# EAGLE design Mosfet Switch (EAGLE 8.4.1)
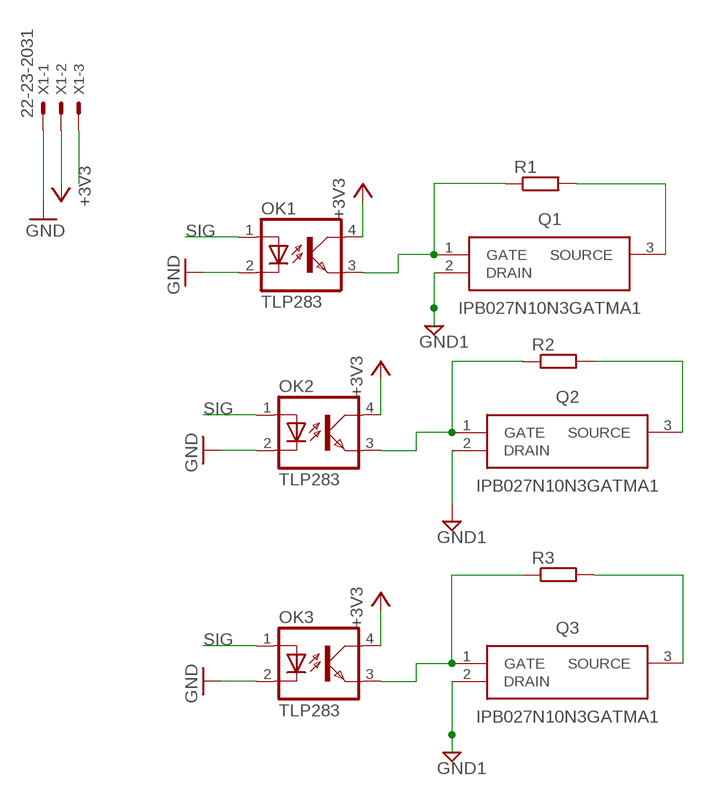
[diagram p0: schematic, sheet 1]

## Parts
OK1  TLP283  [MINI-FLAT-4]
OK2  TLP283  [MINI-FLAT-4]
OK3  TLP283  [MINI-FLAT-4]
Q1  IPB027N10N3GATMA1  [PGTO263-3]
Q2  IPB027N10N3GATMA1  [PGTO263-3]
Q3  IPB027N10N3GATMA1  [PGTO263-3]
R1  R-EU_R0805  [R0805]
R2  R-EU_R0805  [R0805]
R3  R-EU_R0805  [R0805]
X1  22-23-2031  [22-23-2031]

## Nets
+3V3: OK1.4(COL) OK2.4(COL) OK3.4(COL) X1.2
GND1: Q1.2(DRAIN) Q2.2(DRAIN) Q3.2(DRAIN)
GND2: OK1.2(C) OK2.2(C) OK3.2(C) Q1.3(SOURCE) Q2.3(SOURCE) Q3.3(SOURCE) R1.2 R2.2 R3.2 X1.1 ; supply symbol labelled GND
N$1: OK1.3(EMIT) Q1.1(GATE) R1.1
N$4: OK2.3(EMIT) Q2.1(GATE) R2.1
N$5: OK3.3(EMIT) Q3.1(GATE) R3.1
SIG: OK1.1(A) OK2.1(A) OK3.1(A) X1.3

## Library data of the parts
OK1-OK3 = optocoupler:TLP283: TOSHIBA PHOTOCOUPLER GaAs IRED & PHOTO-TRANSISTOR Source: http://www.semicon.toshiba.co.jp/td/en/Opto/Photocoupler/en_20050928_TLP283_datasheet.pdf; OC_FARNELL: unknown; OC_NEWARK: unknown
Q1-Q3 = IPB027N10N3GATMA1:IPB027N10N3GATMA1: INFINEON - IPB027N10N3GATMA1 - MOSFET, N CH, 100V, 120A, TO-263-3 <https://componentsearchengine.com/Images/1/IPB027N10N3GATMA1.jpg> Source: Datasheet <https://www.infineon.com/dgdl/IPB027N10N3 G_Rev2.2.pdf?folderId=db3a304313b8b5a60113cee8763b02d7&fileId=db3a30431ce5fb52011d1ed9348e15ef>; DESCRIPTION: INFINEON - IPB027N10N3GATMA1 - MOSFET, N CH, 100V, 120A, TO-263-3; HEIGHT: mm; MANUFACTURER_NAME: Infineon; MANUFACTURER_PART_NUMBER: IPB027N10N3GATMA1; SUPPLIER_NAME: RS
R1-R3 = resistor:R-EU_: RESISTOR, European symbol
X1 = con-molex:22-23-2031: .100" (2.54mm) Center Header - 3 Pin; MF: MOLEX; MPN: 22-23-2031; OC_FARNELL: 1462950; OC_NEWARK: 30C0862

## Board
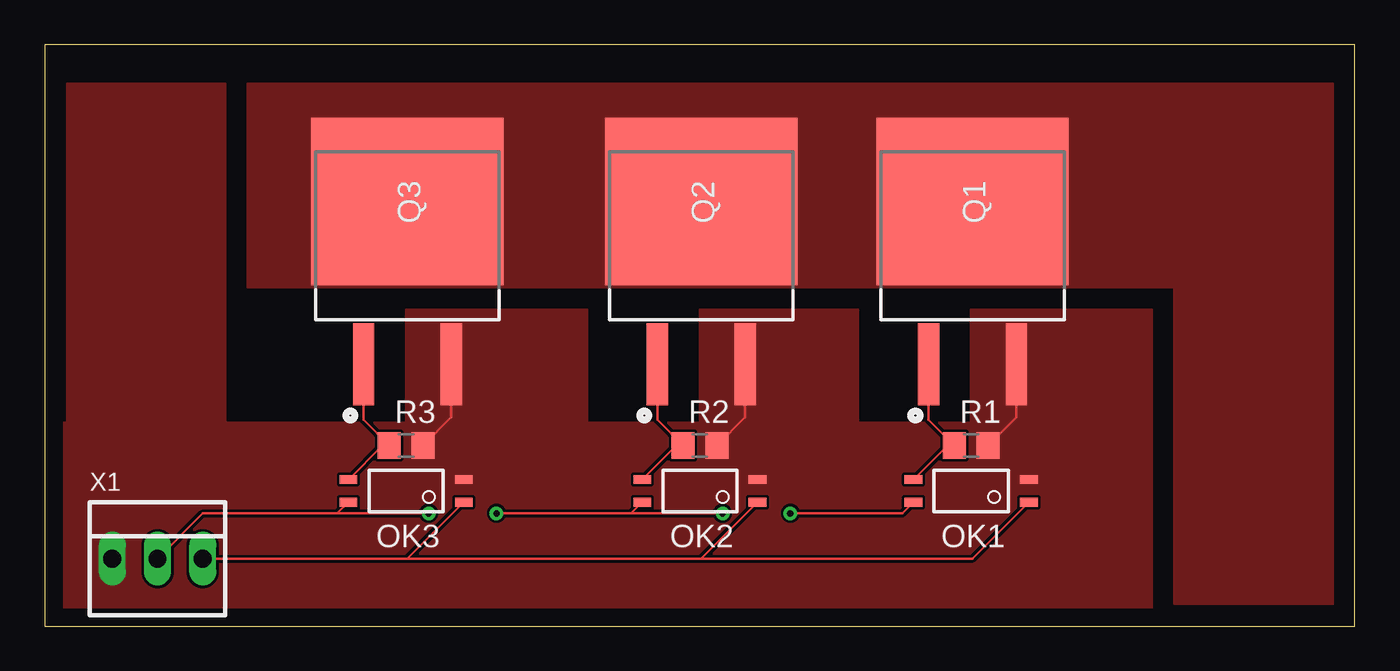
[diagram p1: board, top side]
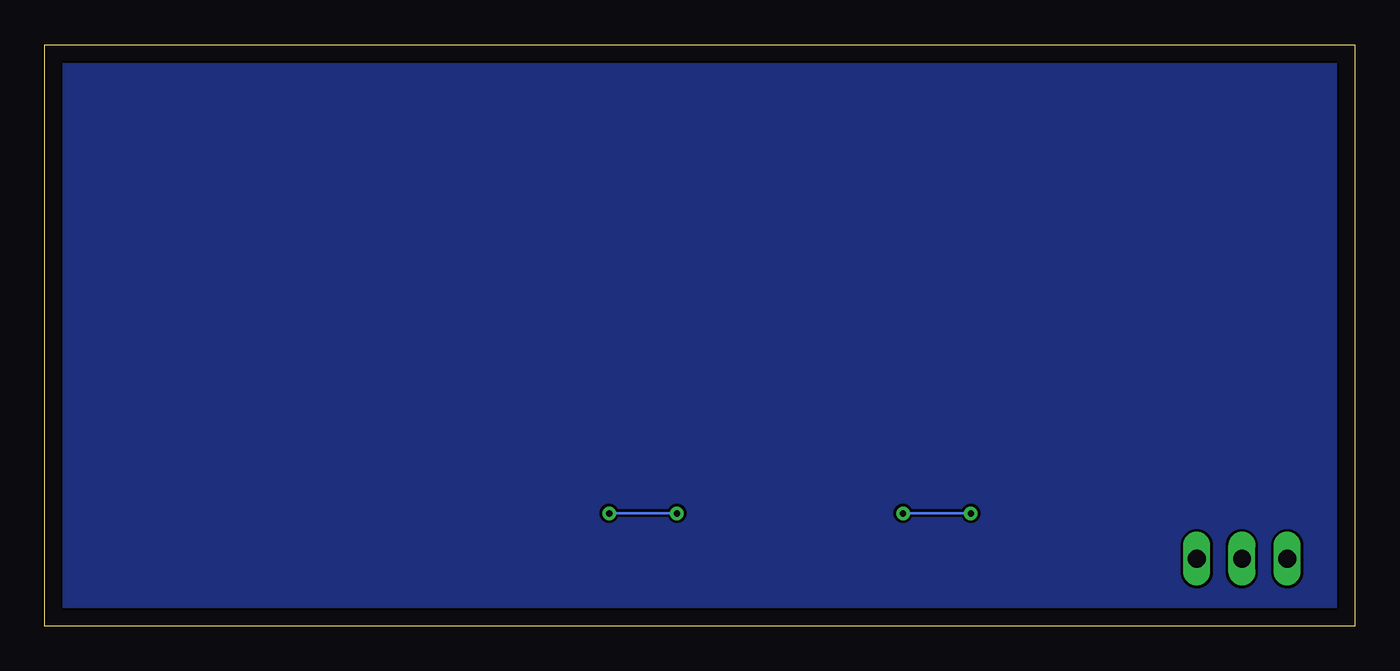
[diagram p2: board, bottom side, seen from below]

Size 73.64 x 32.69 mm. Coordinates in mm from the lower left corner, seen from the top.
Outline: 0,0 73.64,0 73.64,32.69 0,32.69 0,0
Copper layers (1*16): Top 0.035mm / dielectric 1.5mm / Bottom 0.035mm
Design rules "default": minimum track width 6mil, minimum drill 0.35mm, track to track 6mil, track to pad 6mil, pad to pad 6mil, via to via 6mil, smd to smd 6mil, copper to edge 40mil, drill to drill 6mil, minimum pad ring 10mil, minimum via ring 8mil, stop-mask expansion 4mil, vias tented up to drill 0mil, thermal gap 10mil

### Footprints (pad centres in the part's own frame; a part is rotated, then mirrored left to right if it is on the bottom)
MINI-FLAT-4 = smd 1 x 0.5: 1 -3.24,0.635; 2 -3.24,-0.635; 3 3.24,-0.635; 4 3.24,0.635
PGTO263-3 = smd 4.6 x 1.2: 1 11.95,2.691; 3 11.95,7.621 | smd 9.4 x 10.8: 2 2.8,5.156
R0805 = smd 1.3 x 1.5: 1 -0.95,0; 2 0.95,0
22-23-2031 = drill 1 long: 1 -2.54,0; 2 0,0; 3 2.54,0

### Placement (x,y rotation side)
OK1  52.07,7.62 180 top
OK2  36.83,7.62 180 top
OK3  20.32,7.62 180 top
Q1  46.99,26.67 270 top
Q2  31.75,26.67 270 top
Q3  15.24,26.67 270 top
R1  52.07,10.16 0 top
R2  36.83,10.16 0 top
R3  20.32,10.16 0 top
X1  6.35,3.81 0 top

### Tracks (layer width: path | path; a pad name or v marks a point on that pad's centre or on a via)
+3V3  (via drill 0.35)
  Top 0.152: X1.2 8.89,6.35 16.45,6.35 | 16.45,6.35 OK3.4 | v25.4,6.35 32.95,6.35 | 32.95,6.35 OK2.4 | 16.45,6.35 v21.59,6.35 | 32.95,6.35 v38.1,6.35 | v41.91,6.35 48.2,6.35 OK1.4
  Bottom 0.152: v21.59,6.35 v25.4,6.35 | v38.1,6.35 v41.91,6.35
GND1
  pour Top (no thermals): 11.43,30.48 62.23,30.48 62.23,19.05 11.43,19.05
GND2
  Top 0.152: Q2.3 39.37,11.75 R2.2 | Q1.3 54.61,11.75 R1.2 | Q3.3 22.86,11.75 R3.2
  pour Top (no thermals): 30.48,17.78 20.32,17.78 20.32,11.43 30.48,11.43
  pour Top (no thermals): 36.83,17.78 36.83,11.43 45.72,11.43 45.72,17.78
  pour Top (no thermals): 52.07,17.78 52.07,11.43 62.23,11.43 62.23,17.78
  pour Top (no thermals): 0,11.43 62.23,11.43 62.23,0 0,0
N$1
  Top 0.152: Q1.1 49.68,11.6 R1.1 50.73,10.16 OK1.3
N$2
  pour Bottom (no thermals): 0,0 0,33.02 73.66,33.02 73.66,0
N$3
  pour Top: 1.27,10.16 10.16,10.16 10.16,30.48 1.27,30.48
N$4
  Top 0.152: Q2.1 34.44,11.6 R2.1 35.49,10.16 OK2.3
N$5
  Top 0.152: Q3.1 17.93,11.6 R3.1 18.98,10.16 OK3.3
N$6
  pour Top: 59.69,30.48 59.69,19.05 63.5,19.05 63.5,1.27 72.39,1.27 72.39,30.48
SIG
  Top 0.152: X1.3 20.39,3.81 | 20.39,3.81 OK3.1 | 20.39,3.81 36.9,3.81 | 36.9,3.81 OK2.1 | 36.9,3.81 52.13,3.81 OK1.1